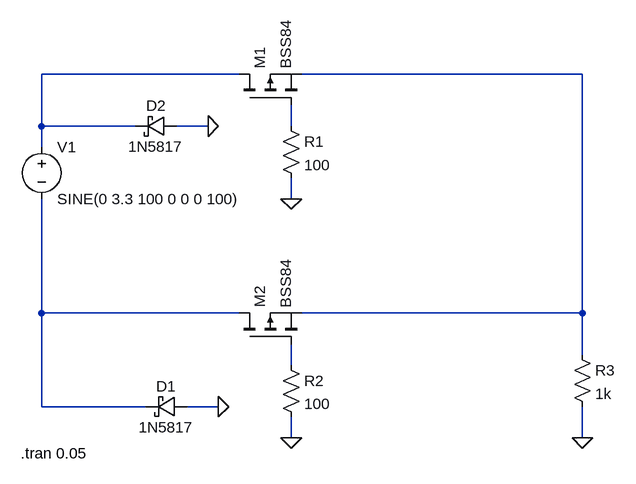
[diagram p0: schematic motor_led.asc]
motor_led.asc, the LTspice schematic file:
Version 4
SHEET 1 880 680
WIRE 112 -128 -192 -128
WIRE 640 -128 208 -128
WIRE -192 -48 -192 -128
WIRE -48 -48 -192 -48
WIRE 64 -48 16 -48
WIRE 192 -48 192 -80
WIRE -192 -16 -192 -48
WIRE 192 64 192 32
WIRE -192 240 -192 64
WIRE 112 240 -192 240
WIRE 640 240 640 -128
WIRE 640 240 208 240
WIRE 640 304 640 240
WIRE 192 320 192 288
WIRE -192 384 -192 240
WIRE -32 384 -192 384
WIRE 80 384 32 384
WIRE 192 432 192 400
WIRE 640 432 640 384
FLAG 192 432 0
FLAG 192 64 0
FLAG 64 -48 0
FLAG 80 384 0
FLAG 640 432 0
SYMBOL pmos 112 -80 R270
SYMATTR InstName M1
SYMATTR Value BSS84
SYMBOL pmos 112 288 R270
SYMATTR InstName M2
SYMATTR Value BSS84
SYMBOL res 176 -64 R0
SYMATTR InstName R1
SYMATTR Value 100
SYMBOL res 176 304 R0
SYMATTR InstName R2
SYMATTR Value 100
SYMBOL voltage -192 -32 R0
WINDOW 123 0 0 Left 0
WINDOW 39 0 0 Left 0
SYMATTR InstName V1
SYMATTR Value SINE(0 3.3 100 0 0 0 100)
SYMBOL schottky 32 368 R90
WINDOW 0 0 32 VBottom 2
WINDOW 3 32 32 VTop 2
SYMATTR InstName D1
SYMATTR Value 1N5817
SYMATTR Description Diode
SYMATTR Type diode
SYMBOL schottky 16 -64 R90
WINDOW 0 0 32 VBottom 2
WINDOW 3 32 32 VTop 2
SYMATTR InstName D2
SYMATTR Value 1N5817
SYMATTR Description Diode
SYMATTR Type diode
SYMBOL res 624 288 R0
SYMATTR InstName R3
SYMATTR Value 1k
TEXT -224 456 Left 2 !.tran 0.05

The netlist it stands for:
* motor_led.asc
M1 N001 N003 N002 N002 BSS84
M2 N004 N005 N002 N002 BSS84
R1 N003 0 100
R2 N005 0 100
V1 N001 N004 SINE(0 3.3 100 0 0 0 100)
D1 0 N004 1N5817
D2 0 N001 1N5817
R3 N002 0 1k
.model D D
.lib standard.dio
.model NMOS NMOS
.model PMOS PMOS
.lib standard.mos
.tran 0.05
.backanno
.end